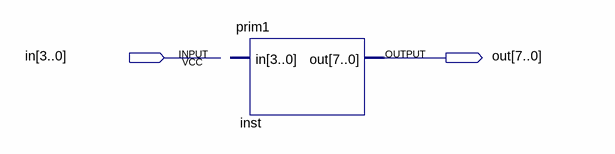
[diagram p0: schematic sheet]
// Quartus schematic test.bdf as structural Verilog: 1 symbols, 2 pins
module test (
  input  [3:0] in,
  output [7:0] out
);

  prim1 inst (.out(out));  // open: in
endmodule
